# Altium schematic sheet PCB_Reflow_Plate.SchDoc: PCB_Reflow_Plate
size A; SheetNumber: 1; SheetTotal: 1
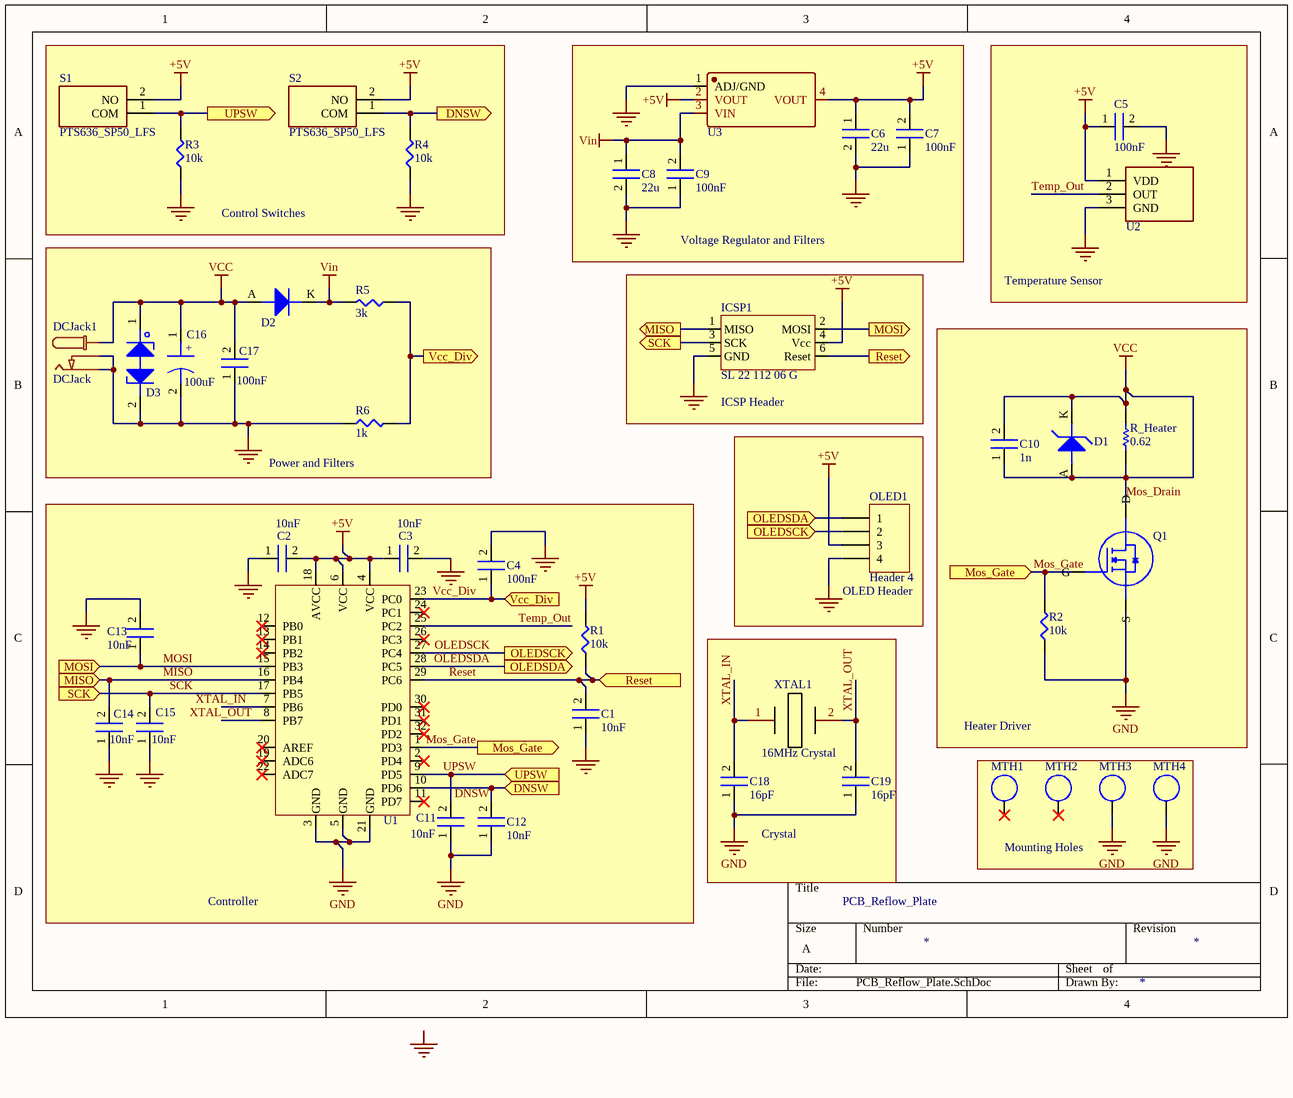
[diagram p0: PCB_Reflow_Plate.SchDoc]

## Parts
C1  Capacitance: 10nF  [0402B103J500CT]  (hidden comment: 10n 0402)
C2  Capacitance: 10nF  [0402B103J500CT]  (hidden comment: 10n 0402)
C3  Capacitance: 10nF  [0402B103J500CT]  (hidden comment: 10n 0402)
C4  Capacitance: 100nF  [0603B104K250CT]  (hidden comment: 100n 0603)
C5  Capacitance: 100nF  [0603B104K250CT]  (hidden comment: 100n 0603)
C6  Capacitance: 22u  [CL21A226MAYNNNE]  (hidden comment: 22u 0805)
C7  Capacitance: 100nF  [0603B104K250CT]  (hidden comment: 100n 0603)
C8  Capacitance: 22u  [CL21A226MAYNNNE]  (hidden comment: 22u 0805)
C9  Capacitance: 100nF  [0603B104K250CT]  (hidden comment: 100n 0603)
C10  Capacitance: 1n  [FM21X102K501PXG]  (hidden comment: 1n 0805)
C11  Capacitance: 10nF  [0402B103J500CT]  (hidden comment: 10n 0402)
C12  Capacitance: 10nF  [0402B103J500CT]  (hidden comment: 10n 0402)
C13  Capacitance: 10nF  [0402B103J500CT]  (hidden comment: 10n 0402)
C14  Capacitance: 10nF  [0402B103J500CT]  (hidden comment: 10n 0402)
C15  Capacitance: 10nF  [0402B103J500CT]  (hidden comment: 10n 0402)
C16  Capacitance: 100uF  [UWT1V101MCL1GS]  (hidden comment: 100u SMD Polarized)
C17  Capacitance: 100nF  [0603B104K250CT]  (hidden comment: 100n 0603)
C18  Capacitance: 16pF  [NMC0603NPO160J50TRPF]  (hidden comment: 16pf 0603 Capacitor)
C19  Capacitance: 16pF  [NMC0603NPO160J50TRPF]  (hidden comment: 16pf 0603 Capacitor)
D1  Zener Diode  [MMSZ24T1G]  (value not drawn)
D2  Diode  [1N4448X-TP]  (value not drawn)
D3  TVS bi-directional  [PESD18VF1BLYL]  (value not drawn)
DCJack1  DCJack  [KLDX-0202-B]
ICSP1  SL 22 112 06 G  [SL 22 112 06 G]
MTH1  Mounting Hole 6mm outer 3mm inner  [MTH_6mmOD_3mmID]  (value not drawn)
MTH2  Mounting Hole 6mm outer 3mm inner  [MTH_6mmOD_3mmID]  (value not drawn)
MTH3  Mounting Hole 6mm outer 3mm inner  [MTH_6mmOD_3mmID]  (value not drawn)
MTH4  Mounting Hole 6mm outer 3mm inner  [MTH_6mmOD_3mmID]  (value not drawn)
OLED1  Header 4  [HDR1X4]
Q1  Mosfet DPAK  [AOD442]  (value not drawn)
R1  Resistance: 10k  [RTT03103JTP]  (hidden comment: 10k 0603)
R2  Resistance: 10k  [RTT03103JTP]  (hidden comment: 10k 0603)
R3  Resistance: 10k  [RTT03103JTP]  (hidden comment: 10k 0603)
R4  Resistance: 10k  [RTT03103JTP]  (hidden comment: 10k 0603)
R5  Resistance: 3k  [RTT05302JTP]  (hidden comment: 3k 0805)
R6  Resistance: 1k  [CR0805-FX-1001ELF]  (hidden comment: 1k 0805)
R_Heater  value 0.62  (hidden comment: Resistor)
S1  PTS636_SP50_LFS  [PTS636_SP50_LFS]
S2  PTS636_SP50_LFS  [PTS636_SP50_LFS]
U1  ATMEGA328P-AU  [atmega328p-au]  (value not drawn)
U2  LMT85LP  [LMT85LP]  (value not drawn)
U3  AMS1117-5.0  [AMS1117-5.0]  (value not drawn)
XTAL1  16MHz Crystal  [ABM7-16.000MHZ-D2Y-T]

## Blocks framed on the sheet
Control Switches: R3 R4 S1 S2
Voltage Regulator and Filters: C6-C9 U3
Temperature Sensor: C5 U2
Power and Filters: C16 C17 D2 D3 DCJack1 R5 R6
ICSP Header: ICSP1
Heater Driver: C10 D1 Q1 R2 R_Heater
OLED Header: OLED1
Controller: C1-C4 C11-C15 R1 U1
Crystal: C18 C19 XTAL1
Mounting Holes: MTH1-MTH4

## Ports
DNSW (in), DNSW (out), MISO (in), MISO (out), Mos_Gate (in), Mos_Gate (out), MOSI (in), MOSI (out), OLEDSCK (in), OLEDSCK (out), OLEDSDA (in), OLEDSDA (out), Reset (in), Reset (out), SCK (in), SCK (out), UPSW (in), UPSW (out), Vcc_Div (in), Vcc_Div (out)

## Nets
+5V: C2.2 C3.1 C5.1 C6.1 C7.2 ICSP1.4(Vcc) OLED1.3 R1.2 S1.2(NO) S2.2(NO) U1.4(VCC) U1.6(VCC) U1.18(AVCC) U2.1(VDD) U3.2(VOUT) U3.4(VOUT)
GND: C1.1 C2.1 C3.2 C4.2 C5.2 C6.2 C7.1 C8.2 C9.1 C11.1 C12.1 C13.2 C14.1 C15.1 C16.2 C17.1 C18.1 C19.1 D3.2 DCJack1.P2 DCJack1.P3 ICSP1.5(GND) MTH3.1 MTH4.1 OLED1.4 Q1.2(S) R2.1 R3.1 R4.1 R6.1 U1.3(GND) U1.5(GND) U1.21(GND) U2.3(GND) U3.1(ADJ/GND)
Mos_Drain: C10.1 C10.2 C16.1 C17.2 D1.A D1.K D2.A D3.1 DCJack1.P1 Q1.1(D) R_Heater.1 R_Heater.2  [also labelled VCC]
Vin: C8.1 C9.2 D2.K R5.2 U3.3(VIN)
DNSW: C12.2 R4.2 S2.1(COM) U1.10(PD6) ; port DNSW
MISO: C14.2 ICSP1.1(MISO) U1.16(PB4) ; port MISO
Mos_Gate: Q1.3(G) R2.2 U1.1(PD3) ; port Mos_Gate
MOSI: C13.1 ICSP1.2(MOSI) U1.15(PB3) ; port MOSI
OLEDSCK: OLED1.2 U1.27(PC4) ; port OLEDSCK
OLEDSDA: OLED1.1 U1.28(PC5) ; port OLEDSDA
Reset: C1.2 ICSP1.6(Reset) R1.1 U1.29(PC6) ; port Reset
SCK: C15.2 ICSP1.3(SCK) U1.17(PB5) ; port SCK
Temp_Out: U1.25(PC2) U2.2(OUT)
UPSW: C11.2 R3.2 S1.1(COM) U1.9(PD5) ; port UPSW
Vcc_Div: C4.1 R5.1 R6.2 U1.23(PC0) ; port Vcc_Div
XTAL_IN: C18.2 U1.7(PB6) XTAL1.1
XTAL_OUT: C19.2 U1.8(PB7) XTAL1.2

Not connected (* = marked no-connect by the designer): MTH1 1*; MTH2 1*; U1 2(PD4)* 11(PD7)* 12(PB0)* 13(PB1)* 14(PB2)* 19(ADC6)* 20(AREF)* 22(ADC7)* 24(PC1)* 26(PC3)* 30(PD0)* 31(PD1)* 32(PD2)*

## Notes on the sheet
- Labels drawn without touching a wire or pin: GND, Mos_Gate
- (in symbol UWT1V101MCL1GS) +

## Library data of the parts
C1-C3 C11-C15 = C1005X7S2A103M050BB: Cap Ceramic 0.01uF 100V X7S 20% SMD 0402 125C Paper T/R; Manufacturer: TDK; Supplier 1: Arrow Electronics; Manufacturer Part Number: C1005X7S2A103M050BB; RoHS: Yes; Category: Ceramic Capacitors; Stock 1: 12146; Pricing 1: 1=0.15740, 10=0.11320, 25=0.08760, 50=0.06570, 100=0.05460, 250=0.05380, 500=0.03850, 1000=0.03230, 3000=0.02830, 6000=0.02780 (USD); Mount: Surface Mount; Case/Package: 0402; Number of Pins: 2; Case Code (Imperial): 0402; Case Code (Metric): 1005; Weight: 2.3E-05oz; Min Operating Temperature: -55°C; Max Operating Temperature: 125°C; Voltage Rating (DC): 100V; Tolerance: 20%; Packaging: Tape and Reel; Voltage Rating: 100V; Dielectric: X7S; Termination: SMD/SMT; Package Quantity: 1; Resistor Type: Ceramic; Series: C; Length: 1mm; Width: 0.5mm; Depth: 0.5mm; Thickness: 0.022inch; Lead Free: Lead Free; RoHS Compliant: Yes; ComponentLink1URL: https://datasheet.ciiva.com/24217/c1005x7s2a103m050bb-264489-24217683.pdf?src-supplier=Mouser; ComponentLink1Description: https://datasheet.ciiva.com/24217/c1005x7s2a103m050bb-264489-24217683.pdf?src-supplier=Mouser; Supplier Part Number 1: C1005X7S2A103M050BB
C4 C5 C7 C9 C17 = GRM188R72A104KA35D: CAP CER 0.1UF 100V X7R 0603; Manufacturer: Murata; Material: Ceramic; Tolerance: 10%; Supplier 1: Arrow Electronics; Manufacturer Part Number: GRM188R72A104KA35D; RoHS: Yes; Category: Ceramic Capacitors; Stock 1: 360000; Pricing 1: 4000=0.04400 (USD); Mount: Surface Mount; Case/Package: 0603; Weight: 0.000222oz; Case Code (Imperial): 0603; Case Code (Metric): 1608; Min Operating Temperature: -55°C; Max Operating Temperature: 125°C; Dielectric: X7R; Voltage Rating: 100V; Voltage Rating (DC): 100V; Packaging: Tape and Reel; Package Quantity: 1; Termination: SMD/SMT; Voltage: 100V; Series: GRM; Construction: Flat; Length: 1.6mm; Width: 0.8mm; Height: 0.8mm; Thickness: 0.035inch; Depth: 0.8mm; Size: 0.8mm; Radiation Hardening: No; REACH SVHC: No SVHC; Lead Free: Lead Free; RoHS Compliant: Yes; ComponentLink1URL: https://datasheet.ciiva.com/22703/1747473-22703345.pdf?src-supplier=Element14; ComponentLink1Description: https://datasheet.ciiva.com/22703/1747473-22703345.pdf?src-supplier=Element14; ComponentLink2URL: https://datasheet.ciiva.com/34302/1857815-34302863.pdf?src-supplier=Jameco; ComponentLink2Description: https://datasheet.ciiva.com/34302/1857815-34302863.pdf?src-supplier=Jameco; ComponentLink3URL: https://datasheet.ciiva.com/11787/0900766b80ef921d-11787064.pdf?src-supplier=RSComponents; ComponentLink3Description: https://datasheet.ciiva.com/11787/0900766b80ef921d-11787064.pdf?src-supplier=RSComponents; ComponentLink4URL: https://datasheet.ciiva.com/18100/getdatasheetpartid-27818-18100710.pdf?src-supplier=Verical; ComponentLink4Description: https://datasheet.ciiva.com/18100/getdatasheetpartid-27818-18100710.pdf?src-supplier=Verical; ComponentLink5URL: https://datasheet.ciiva.com/29201/451984-da-01-en-vs-kondensator-0603-29201725.pdf?src-supplier=Conrad; ComponentLink5Description: https://datasheet.ciiva.com/29201/451984-da-01-en-vs-kondensator-0603-29201725.pdf?src-supplier=Conrad; ComponentLink6URL: https://datasheet.ciiva.com/7937/1747473-7937676.pdf?src-supplier=Element14; ComponentLink6Description: https://datasheet.ciiva.com/7937/1747473-7937676.pdf?src-supplier=Element14; ComponentLink7URL: https://datasheet.ciiva.com/135/partnumbering-e-01-135140.pdf?src-supplier=Digi-Key; ComponentLink7Description: https://datasheet.ciiva.com/135/partnumbering-e-01-135140.pdf?src-supplier=Digi-Key; ComponentLink8URL: https://datasheet.ciiva.com/135/partnumbering-e-01-135139.pdf?src-supplier=Digi-Key; ComponentLink8Description: https://datasheet.ciiva.com/135/partnumbering-e-01-135139.pdf?src-supplier=Digi-Key; ComponentLink9URL: https://datasheet.ciiva.com/135/partnumbering-e-01-135141.pdf?src-supplier=Digi-Key; ComponentLink9Description: https://datasheet.ciiva.com/135/partnumbering-e-01-135141.pdf?src-supplier=Digi-Key; ComponentLink10URL: https://datasheet.ciiva.com/16382/product-16382965.pdf?src-supplier=Future+Electronics; ComponentLink10Description: https://datasheet.ciiva.com/16382/product-16382965.pdf?src-supplier=Future+Electronics; Supplier Part Number 1: GRM188R72A104KA35D
C6 C8 = CL21A226MAYNNNE: 25V 22uF X5R ±20% 0805 Multilayer Ceramic Capacitors MLCC - SMD/SMT ROHS; Manufacturer: Samsung; Supplier 1: LCSC; Manufacturer Part Number: CL21A226MAYNNNE; RoHS: Yes; Category: Ceramic Capacitors; Stock 1: 9380620; Pricing 1: 20=0.01460, 200=0.01420, 600=0.01420, 2000=0.01420, 10000=0.01420, 20000=0.01420 (USD); RoHS Compliant: Yes; Supplier Part Number 1: C602037
C10 = GRM21AR72E102KW01D: 0805 1 nF 250 V ±10% Tolerance X7R SMT Multilayer Ceramic Capacitor; Manufacturer: Murata; Voltage Rating: 250V; Supplier 1: Arrow Electronics; Manufacturer Part Number: GRM21AR72E102KW01D; RoHS: Yes; Category: Ceramic Capacitors; Stock 1: 28000; Pricing 1: 4000=0.07440, 8000=0.06810, 12000=0.06640, 28000=0.06360, 100000=0.05520 (USD); Mount: Surface Mount; Case/Package: 0805; Case Code (Metric): 2012; Case Code (Imperial): 0805; Material: Ceramic; Min Operating Temperature: -55°C; Max Operating Temperature: 125°C; Tolerance: 10%; Dielectric: X7R; Package Quantity: 4000; Packaging: Tape and Reel; Voltage Rating (DC): 250V; Termination: SMD/SMT; Voltage: 250V; Series: GRM; Construction: Flat; Length: 2mm; Width: 1.25mm; Height: 1mm; Depth: 1.25mm; Thickness: 0.039inch; Radiation Hardening: No; Lead Free: Lead Free; RoHS Compliant: Yes; ComponentLink1URL: https://datasheet.ciiva.com/3778/12716grm21ar72e102kw0123-3778089.pdf?src-supplier=Arrow+Electronics; ComponentLink1Description: https://datasheet.ciiva.com/3778/12716grm21ar72e102kw0123-3778089.pdf?src-supplier=Arrow+Electronics; ComponentLink2URL: https://datasheet.ciiva.com/134/partnumbering-e-01-134212.pdf?src-supplier=Digi-Key; ComponentLink2Description: https://datasheet.ciiva.com/134/partnumbering-e-01-134212.pdf?src-supplier=Digi-Key; ComponentLink3URL: https://datasheet.ciiva.com/134/partnumbering-e-01-134213.pdf?src-supplier=Digi-Key; ComponentLink3Description: https://datasheet.ciiva.com/134/partnumbering-e-01-134213.pdf?src-supplier=Digi-Key; ComponentLink4URL: https://datasheet.ciiva.com/134/partnumbering-e-01-134214.pdf?src-supplier=Digi-Key; ComponentLink4Description: https://datasheet.ciiva.com/134/partnumbering-e-01-134214.pdf?src-supplier=Digi-Key; Supplier Part Number 1: GRM21AR72E102KW01D
C16 = UWT1V101MCL1GS: -45℃~+105℃ 1000hrs@105℃ 100uF 7.7mm 35V 6.3mm ±20% SMD,D6.3xL7.7mm Aluminum Electrolytic Capacitors - SMD ROHS; Manufacturer: Nichicon; Dielectric Material: Aluminium; Ripple Current (AC): 84mA; Leakage Current: 3uA; Life (Hours): 1000Hour; Dissipation Factor: 0.14%; Lead Diameter: 0.8mm; Supplier 1: LCSC; Manufacturer Part Number: UWT1V101MCL1GS; RoHS: Yes; Category: Aluminum Electrolytic Capacitors; Stock 1: 986890; Pricing 1: 5=0.08560, 50=0.06960, 150=0.06140, 500=0.05460, 2500=0.05220, 5000=0.05060 (USD); Mount: Surface Mount,PCB; Case/Package: Radial; Number of Pins: 2; Min Operating Temperature: -55°C; Max Operating Temperature: 105°C; Tolerance: 20%; Voltage Rating: 35V; Packaging: Tape and Reel; Package Quantity: 900; Ripple Current: 84mA; Voltage Rating (DC): 35V; Termination: SMD/SMT; Voltage: 35V; Series: WT; Construction: Cylindrical; Diameter: 6.3mm; Length: 7.7mm; Height: 7.7mm; Lead Pitch: 2.2mm; Height - Seated (Max): 0.303inch; Radiation Hardening: No; REACH SVHC: No SVHC; Lead Free: Lead Free; RoHS Compliant: Yes; ComponentLink1URL: https://datasheet.ciiva.com/96/e-wt-96660.pdf?src-supplier=Digi-Key; ComponentLink1Description: https://datasheet.ciiva.com/96/e-wt-96660.pdf?src-supplier=Digi-Key; ComponentLink2URL: https://datasheet.ciiva.com/96/e-wt-96659.pdf?src-supplier=Digi-Key; ComponentLink2Description: https://datasheet.ciiva.com/96/e-wt-96659.pdf?src-supplier=Digi-Key; ComponentLink3URL: https://datasheet.ciiva.com/96/e-wt-96661.pdf?src-supplier=Digi-Key; ComponentLink3Description: https://datasheet.ciiva.com/96/e-wt-96661.pdf?src-supplier=Digi-Key; ComponentLink4URL: https://datasheet.ciiva.com/11778/0900766b80fa3a91-11778473.pdf?src-supplier=RSComponents; ComponentLink4Description: https://datasheet.ciiva.com/11778/0900766b80fa3a91-11778473.pdf?src-supplier=RSComponents; ComponentLink5URL: https://datasheet.ciiva.com/11687/e-wt-11687372.pdf?src-supplier=Avnet; ComponentLink5Description: https://datasheet.ciiva.com/11687/e-wt-11687372.pdf?src-supplier=Avnet; ComponentLink6URL: https://datasheet.ciiva.com/16294/e-wt-16294316.pdf?src-supplier=Future+Electronics; ComponentLink6Description: https://datasheet.ciiva.com/16294/e-wt-16294316.pdf?src-supplier=Future+Electronics; ComponentLink7URL: https://datasheet.ciiva.com/15199/getdatasheetpartid-450031-15199274.pdf?src-supplier=Verical; ComponentLink7Description: https://datasheet.ciiva.com/15199/getdatasheetpartid-450031-15199274.pdf?src-supplier=Verical; Supplier Part Number 1: C125975
C18 C19 = NMC0603NPO160J50TRPF: Cap Ceramic 16pF 50V C0G 5% SMD 0603 125°C Paper T/R; Manufacturer: NIC Components; Supplier 1: Arrow Electronics; Manufacturer Part Number: NMC0603NPO160J50TRPF; RoHS: Yes; Category: Ceramic Capacitors; Stock 1: 3200; Pricing 1: 1=0.00630, 10=0.00560, 25=0.00470 (USD); Mount: Surface Mount; Case/Package: 0603; Min Operating Temperature: -55°C; Max Operating Temperature: 125°C; Tolerance: 5%; Packaging: Tape and Reel; Dielectric: C0G; Construction: Flat; Length: 1.6mm; Depth: 0.8mm; Radiation Hardening: No; RoHS Compliant: Yes; ComponentLink1URL: https://datasheet.ciiva.com/11602/nmc1-11602959.pdf?src-supplier=Avnet; ComponentLink1Description: https://datasheet.ciiva.com/11602/nmc1-11602959.pdf?src-supplier=Avnet; Supplier Part Number 1: NMC0603NPO160J50TRPF
D1 = MMSZ24T1G: Zener Single Diode, 24 V, 500 mW, SOD-123, 5 %, 2, 150 C RoHS Compliant: Yes; Manufacturer: ON Semiconductor; Max Power Dissipation: 500mW; Zener Voltage: 24V; Max Reverse Leakage Current: 50nA; Tolerance: 5%; Impedance: 70R; Test Current: 5mA; Forward Voltage: 900mV; Zener Current: 10mA; Supplier 1: Arrow Electronics; Manufacturer Part Number: MMSZ24T1G; RoHS: Yes; Category: Zener Diodes; Stock 1: 86820; Pricing 1: 1=0.22650, 10=0.18600, 25=0.17690, 100=0.10080, 250=0.09980, 500=0.07220, 1000=0.05330, 3000=0.04250, 6000=0.03220, 15000=0.02660, 30000=0.02630, 75000=0.02610 (USD); Case/Package: SOD-123-2; Number of Pins: 2; Contact Plating: Tin,Matte; Min Operating Temperature: -55°C; Max Operating Temperature: 150°C; Packaging: Tape and Reel; Element Configuration: Single; Package Quantity: 1; Voltage Tolerance: 5%; Power Rating: 500mW; Voltage Rating (DC): 24V; Power Dissipation: 500mW; Working Voltage: 24V; Max Reverse Current: 50nA; ESD Protection: Yes; Length: 2.84mm; Width: 1.8mm; Height: 1.25mm; Radiation Hardening: No; Lead Free: Lead Free; REACH SVHC: No SVHC; ComponentLink1URL: https://datasheet.ciiva.com/15142/getdatasheetpartid-53226-15142109.pdf?src-supplier=Verical; ComponentLink1Description: https://datasheet.ciiva.com/15142/getdatasheetpartid-53226-15142109.pdf?src-supplier=Verical; ComponentLink2URL: https://datasheet.ciiva.com/895/mmsz2v4t1-d-895073.pdf?src-supplier=Digi-Key; ComponentLink2Description: https://datasheet.ciiva.com/895/mmsz2v4t1-d-895073.pdf?src-supplier=Digi-Key; ComponentLink3URL: https://datasheet.ciiva.com/895/mmsz2v4t1-d-895074.pdf?src-supplier=Digi-Key; ComponentLink3Description: https://datasheet.ciiva.com/895/mmsz2v4t1-d-895074.pdf?src-supplier=Digi-Key; ComponentLink4URL: https://datasheet.ciiva.com/895/mmsz2v4t1-d-895075.pdf?src-supplier=Digi-Key; ComponentLink4Description: https://datasheet.ciiva.com/895/mmsz2v4t1-d-895075.pdf?src-supplier=Digi-Key; ComponentLink5URL: https://datasheet.ciiva.com/16396/mmsz2v4t1-d-16396045.pdf?src-supplier=Future+Electronics; ComponentLink5Description: https://datasheet.ciiva.com/16396/mmsz2v4t1-d-16396045.pdf?src-supplier=Future+Electronics; Supplier Part Number 1: MMSZ24T1G
D2 = 1N4448X-TP: 1N4448X Series 4 A 75 V 150 mW Surface Mount Switching Diode - SOD-523; Manufacturer: MCC; Forward Current: 500mA; Max Surge Current: 4A; Forward Voltage: 1.25V; Recovery Time: 4ns; Polarity: Standard; Voltage Rating (DC): 75V; Current Rating: 150mA; Capacitance: 4pF; Average Rectified Current: 250mA; Max Reverse Leakage Current: 2.5uA; Power Dissipation: 150mW; Element Configuration: Single; Supplier 1: Arrow Electronics; Manufacturer Part Number: 1N4448X-TP; RoHS: Yes; Category: Rectifier Diodes; Stock 1: 216000; Pricing 1: 8000=0.03630, 24000=0.03380, 48000=0.02910 (USD); Mount: Surface Mount; Number of Pins: 2; Min Operating Temperature: -65°C; Max Operating Temperature: 150°C; Package Quantity: 1; Packaging: Tape and Reel; Output Current: 500mA; Reverse Recovery Time: 4ns; Max Repetitive Reverse Voltage (Vrrm): 75V; Peak Non-Repetitive Surge Current: 4A; Max Reverse Voltage (DC): 75V; Lead Free: Lead Free; ComponentLink1URL: https://datasheet.ciiva.com/916/1n4448xsod-523-916912.pdf?src-supplier=Digi-Key; ComponentLink1Description: https://datasheet.ciiva.com/916/1n4448xsod-523-916912.pdf?src-supplier=Digi-Key; ComponentLink2URL: https://datasheet.ciiva.com/16836/1n4448xsod-523-16836341.pdf?src-supplier=Future+Electronics; ComponentLink2Description: https://datasheet.ciiva.com/16836/1n4448xsod-523-16836341.pdf?src-supplier=Future+Electronics; Supplier Part Number 1: 1N4448X-TP
D3 = PESD18VF1BLYL: TVS DIODE 18VWM 17VC SOD882; Manufacturer: Nexperia; Supplier 1: Arrow Electronics; Manufacturer Part Number: PESD18VF1BLYL; RoHS: Yes; Category: ESD and Circuit Protection ICs; Stock 1: 6792; Pricing 1: 1=0.35670, 10=0.07470, 25=0.07380, 100=0.07320, 250=0.06160, 500=0.06100, 1000=0.05850, 3000=0.05790, 6000=0.05730 (USD); RoHS Compliant: Yes; ComponentLink1URL: http://www.farnell.com/datasheets/1738914.pdf?src-supplier=Farnell; ComponentLink1Description: http://www.farnell.com/datasheets/1738914.pdf?src-supplier=Farnell; ComponentLink2URL: http://www.farnell.com/datasheets/1738914.pdf?src-supplier=Newark; ComponentLink2Description: http://www.farnell.com/datasheets/1738914.pdf?src-supplier=Newark; ComponentLink3URL: https://assets.nexperia.com/documents/data-sheet/PESD18VF1BL.pdf?src-supplier=Digi-Key; ComponentLink3Description: https://assets.nexperia.com/documents/data-sheet/PESD18VF1BL.pdf?src-supplier=Digi-Key; Supplier Part Number 1: PESD18VF1BLYL
DCJack1 = KLDX-0202-B: Conn Power PIN 2 POS Solder RA Thru-Hole 3 Terminal 1 Port; Manufacturer: Kycon; Gender: Female; Current Rating: 3.5A; Voltage Rating: 24V; Insulation Resistance: 100MR; Number of Contacts: 2; Supplier 1: Digi-Key; Manufacturer Part Number: KLDX-0202-B; RoHS: Yes; Category: Power Connectors; Stock 1: 90692; Pricing 1: 1=0.74000, 10=0.62400, 25=0.59800, 50=0.58540, 100=0.55990, 250=0.50904, 500=0.45814, 1000=0.40723, 2500=0.36906 (USD); Mount: Through Hole; Contact Material: Brass; Contact Plating: Tin; Housing Material: PBT; Color: Black; Min Operating Temperature: -25°C; Max Operating Temperature: 85°C; Connector Type: Power; Packaging: Bag; Termination: Solder; Contact Gender: Female; Package Quantity: 500; Voltage Rating (DC): 24V; Orientation: Right Angle; Flammability Rating: UL94 V-0; ComponentLink1URL: https://datasheet.ciiva.com/4561/kldx-0202-x-184473-4561491.pdf?src-supplier=Mouser; ComponentLink1Description: https://datasheet.ciiva.com/4561/kldx-0202-x-184473-4561491.pdf?src-supplier=Mouser; Supplier Part Number 1: 2092-KLDX-0202-B-ND
ICSP1 = SL 22 112 06 G: Conn Unshrouded Header M 6 POS 2.54mm Solder ST Thru-Hole; Manufacturer: Fischer Elektronik; Max Current Rating: 3A; Max Voltage Rating (AC): 250V; Gender: Male; Supplier 1: Arrow Electronics; Manufacturer Part Number: SL 22 112 06 G; RoHS: Yes; Category: Headers and Wire Housings; Stock 1: 6120; Pricing 1: 1=0.53140, 25=0.53130, 50=0.53120, 100=0.53110 (USD); Contact Plating: Gold; Contact Material: Bronze; Housing Material: Polyamide; Min Operating Temperature: -40°C; Max Operating Temperature: 163°C; Number of Rows: 2; Termination: Solder; Orientation: Straight; Length: 15.24mm; Pitch: 2.54mm; Depth: 5mm; ComponentLink1URL: https://datasheet.ciiva.com/26853/getdatasheetpartid-646250-26853533.pdf?src-supplier=Verical; ComponentLink1Description: https://datasheet.ciiva.com/26853/getdatasheetpartid-646250-26853533.pdf?src-supplier=Verical; Supplier Part Number 1: SL 22 112 06 G
MTH1-MTH4 = MTH_6mmOD_3mmID: Mounting Hole 6mm outer 3mm inner drill
OLED1 = Header 4: Header, 4-Pin; LatestRevisionDate: 17-Jul-2002; LatestRevisionNote: Re-released for DXP Platform.; Publisher: Altium Limited
Q1 = AOD442: Trans MOSFET N-CH 60V 37A 3-Pin(2+Tab) DPAK; Manufacturer: Alpha & Omega Semiconductor; Rds On Max: 20mR; Input Capacitance: 2.3nF; Max Power Dissipation: 2.1W; Gate to Source Voltage (Vgs): 20V; Number of Elements: 1; Power Dissipation: 60W; Supplier 1: LCSC; Manufacturer Part Number: AOD442; RoHS: Yes; Category: MOSFETs; Stock 1: 14654; Pricing 1: 1=0.66730, 10=0.54640, 30=0.48690, 100=0.42740, 500=0.39140, 1000=0.37330 (USD); Mount: Surface Mount; Case/Package: DPAK; Number of Pins: 3; Min Operating Temperature: -55°C; Max Operating Temperature: 175°C; Packaging: Tape and Reel; Drain to Source Voltage (Vdss): 60V; Continuous Drain Current (ID): 37A; Radiation Hardening: No; Lead Free: Lead Free; ComponentLink1URL: https://datasheet.ciiva.com/6384/aod442-6384657.pdf?src-supplier=Digi-Key; ComponentLink1Description: https://datasheet.ciiva.com/6384/aod442-6384657.pdf?src-supplier=Digi-Key; ComponentLink2URL: https://datasheet.ciiva.com/6384/aod442-6384651.pdf?src-supplier=Digi-Key; ComponentLink2Description: https://datasheet.ciiva.com/6384/aod442-6384651.pdf?src-supplier=Digi-Key; ComponentLink3URL: https://datasheet.ciiva.com/6384/aod442-6384654.pdf?src-supplier=Digi-Key; ComponentLink3Description: https://datasheet.ciiva.com/6384/aod442-6384654.pdf?src-supplier=Digi-Key; Supplier Part Number 1: C87617
R1-R4 = RT0603DRE0710KL: Res Thin Film 0603 10K Ohm 0.5% 0.1W(1/10W) ±50ppm/°C Pad SMD T/R; Manufacturer: Yageo; Power Rating: 100mW; Voltage Rating: 75V; Voltage Rating (DC): 50V; Supplier 1: Arrow Electronics; Manufacturer Part Number: RT0603DRE0710KL; RoHS: Yes; Category: Chip SMD Resistors; Stock 1: 4505; Pricing 1: 1=0.09190, 10=0.07850, 25=0.04030, 100=0.02970, 250=0.01780, 500=0.01770, 1000=0.01580, 3000=0.01220 (USD); Case/Package: 0603; Case Code (Metric): 1608; Case Code (Imperial): 0603; Size Code: 0603; Min Operating Temperature: -55°C; Max Operating Temperature: 125°C; Package Quantity: 5000; Packaging: Tape and Reel; Tolerance: 0.5%; Resistor Type: Thin Film; Number of Terminations: 2; Termination: SMD/SMT; Max Power Dissipation: 100mW; Temperature Coefficient: 50ppm/°C; Features: Moisture Resistant; Series: RT; Construction: Rectangular; Length: 0.063inch; Width: 0.031inch; Height: 0.022inch; Depth: 0.8mm; RoHS Compliant: Yes; Military Standard: Not; Lead Free: Lead Free; ComponentLink1URL: https://datasheet.ciiva.com/2565/pyu-rt-1-to-0-05-rohs-l-5-2565939.pdf?src-supplier=Digi-Key; ComponentLink1Description: https://datasheet.ciiva.com/2565/pyu-rt-1-to-0-05-rohs-l-5-2565939.pdf?src-supplier=Digi-Key; Supplier Part Number 1: RT0603DRE0710KL
R5 = RC0805FR-073KL: Res Thick Film 0805 3K Ohm 1% 0.125W(1/8W) ±100ppm/C Pad SMD T/R; Manufacturer: Yageo; Temperature Coefficient: 100ppm/°C; Voltage Rating (DC): 150V; Power Rating: 125mW; Supplier 1: Arrow Electronics; Manufacturer Part Number: RC0805FR-073KL; RoHS: Yes; Category: Chip SMD Resistors; Stock 1: 75000; Pricing 1: 5000=0.00470 (USD); Mount: Surface Mount; Case/Package: 0805; Case Code (Metric): 2012; Case Code (Imperial): 0805; Size Code: 0805; Min Operating Temperature: -55°C; Max Operating Temperature: 155°C; Tolerance: 1%; Packaging: Tape and Reel; Resistor Type: Thick Film; Package Quantity: 1; Voltage Rating: 150V; Number of Terminations: 2; Termination: SMD/SMT; Max Power Dissipation: 125mW; Features: Moisture Resistant; Series: RC; Construction: Rectangular; Length: 2mm; Width: 0.049inch; Height: 0.024inch; Depth: 1.25mm; Lead Free: Lead Free; Military Standard: Not; RoHS Compliant: Yes; ComponentLink1URL: https://datasheet.ciiva.com/2457/pyu-r-int-thick-7-2457135.pdf?src-supplier=Digi-Key; ComponentLink1Description: https://datasheet.ciiva.com/2457/pyu-r-int-thick-7-2457135.pdf?src-supplier=Digi-Key; ComponentLink2URL: https://datasheet.ciiva.com/2457/pyu-r-int-thick-7-2457136.pdf?src-supplier=Digi-Key; ComponentLink2Description: https://datasheet.ciiva.com/2457/pyu-r-int-thick-7-2457136.pdf?src-supplier=Digi-Key; ComponentLink3URL: https://datasheet.ciiva.com/2457/pyu-r-int-thick-7-2457134.pdf?src-supplier=Digi-Key; ComponentLink3Description: https://datasheet.ciiva.com/2457/pyu-r-int-thick-7-2457134.pdf?src-supplier=Digi-Key; ComponentLink4URL: https://datasheet.ciiva.com/5558/rc0805-5558124.pdf?src-supplier=Mouser; ComponentLink4Description: https://datasheet.ciiva.com/5558/rc0805-5558124.pdf?src-supplier=Mouser; ComponentLink5URL: https://datasheet.ciiva.com/17043/rc0805-17043750.pdf?src-supplier=Future+Electronics; ComponentLink5Description: https://datasheet.ciiva.com/17043/rc0805-17043750.pdf?src-supplier=Future+Electronics; Supplier Part Number 1: RC0805FR-073KL
R6 = CR0805-FX-1001ELF: 125mW ±100ppm/℃ ±1% 1kΩ 0805 Chip Resistor - Surface Mount ROHS; Manufacturer: Bourns; Temperature Coefficient: 100ppm/°C; Voltage Rating: 150V; Supplier 1: Arrow Electronics; Manufacturer Part Number: CR0805-FX-1001ELF; RoHS: Yes; Category: Chip SMD Resistors; Stock 1: 100000; Pricing 1: 100000=0.00430 (USD); Mount: Surface Mount; Case/Package: 0805; Number of Pins: 2; Contact Plating: Tin; Case Code (Imperial): 0805; Case Code (Metric): 2012; Min Operating Temperature: -55°C; Max Operating Temperature: 155°C; Tolerance: 1%; Resistor Type: Thick Film; Packaging: Tape and Reel; Power Rating: 125mW; Package Quantity: 1; Termination: SMD/SMT; Number of Terminations: 2; Max Power Dissipation: 125mW; Voltage Rating (DC): 150V; Features: Moisture Resistant; Series: CR0805; Resistance Tolerance: 1%; Technology: THICK FILM; Length: 2mm; Width: 1.25mm; Height: 0.5mm; Depth: 1.25mm; Thickness: 508um; Radiation Hardening: No; REACH SVHC: No SVHC; RoHS Compliant: Yes; ComponentLink1URL: https://datasheet.ciiva.com/11810/0900766b80fcdb72-11810305.pdf?src-supplier=RSComponents; ComponentLink1Description: https://datasheet.ciiva.com/11810/0900766b80fcdb72-11810305.pdf?src-supplier=RSComponents; ComponentLink2URL: https://datasheet.ciiva.com/27049/775383-27049976.pdf?src-supplier=Jameco; ComponentLink2Description: https://datasheet.ciiva.com/27049/775383-27049976.pdf?src-supplier=Jameco; ComponentLink3URL: https://datasheet.ciiva.com/16722/70154685-16722677.pdf?src-supplier=Allied+Electronics; ComponentLink3Description: https://datasheet.ciiva.com/16722/70154685-16722677.pdf?src-supplier=Allied+Electronics; ComponentLink4URL: https://datasheet.ciiva.com/9123/chpreztr-9123643.pdf?src-supplier=Avnet; ComponentLink4Description: https://datasheet.ciiva.com/9123/chpreztr-9123643.pdf?src-supplier=Avnet; ComponentLink5URL: https://datasheet.ciiva.com/6547/chpreztr-6547421.pdf?src-supplier=Digi-Key; ComponentLink5Description: https://datasheet.ciiva.com/6547/chpreztr-6547421.pdf?src-supplier=Digi-Key; ComponentLink6URL: https://datasheet.ciiva.com/30129/159chpreztr-30129981.pdf?src-supplier=Onlinecomponents.com; ComponentLink6Description: https://datasheet.ciiva.com/30129/159chpreztr-30129981.pdf?src-supplier=Onlinecomponents.com; ComponentLink7URL: https://datasheet.ciiva.com/6547/chpreztr-6547422.pdf?src-supplier=Digi-Key; ComponentLink7Description: https://datasheet.ciiva.com/6547/chpreztr-6547422.pdf?src-supplier=Digi-Key; ComponentLink8URL: https://datasheet.ciiva.com/46394/691949-46394380.pdf?src-supplier=Element14; ComponentLink8Description: https://datasheet.ciiva.com/46394/691949-46394380.pdf?src-supplier=Element14; ComponentLink9URL: https://datasheet.ciiva.com/7986/1856384-7986222.pdf?src-supplier=Element14; ComponentLink9Description: https://datasheet.ciiva.com/7986/1856384-7986222.pdf?src-supplier=Element14; ComponentLink10URL: https://datasheet.ciiva.com/6547/chpreztr-6547423.pdf?src-supplier=Digi-Key; ComponentLink10Description: https://datasheet.ciiva.com/6547/chpreztr-6547423.pdf?src-supplier=Digi-Key; ComponentLink11URL: https://datasheet.ciiva.com/48692/001055506-da-01-en-smd-wid-cr0805-fx-1001elf-1k-ohm-1-8w-48692106.pdf?src-supplier=Conrad; ComponentLink11Description: https://datasheet.ciiva.com/48692/001055506-da-01-en-smd-wid-cr0805-fx-1001elf-1k-ohm-1-8w-48692106.pdf?src-supplier=Conrad; Supplier Part Number 1: CR0805-FX-1001ELF
R_Heater = Resistor: TC1: 0; SimulationGenericComponent: True; TC2: 0
S1 S2 = PTS636_SP50_LFS: Switch; Manufacturer: C & K COMPONENTS; Manufacturer Part Number: PTS636 SP50 LFS; Datasheet Link: https://www.ckswitches.com/media/2779/pts636.pdf; Height: 4.5mm; Supplier 1: Arrow Electronics; Arrow Price/Stock: https://www.arrow.com/en/products/pts636-sp50-lfs/ck; Supplier Part Number 1: PTS636 SP50 LFS
U1 = ATMEGA328P-AU: 2KB 16K@x16bit -40℃~+85℃ 1.8V~5.5V AVR 1@x8ch/10bit Internal oscillator included 20MHz 23 1KB TQFP-32_7x7x08P Microcontroller Units (MCUs/MPUs/SOCs) ROHS; Manufacturer: Microchip; Supplier 1: LCSC; Manufacturer Part Number: ATMEGA328P-AU; RoHS: Yes; Category: Microcontrollers; Stock 1: 9922; Pricing 1: 1=4.54970, 10=4.01960, 30=3.74910, 100=3.38840, 500=3.25860, 1000=3.20270 (USD); Case/Package: TQFP; RoHS Compliant: Yes; ComponentLink1URL: http://www.farnell.com/datasheets/2047852.pdf?src-supplier=Farnell; ComponentLink1Description: http://www.farnell.com/datasheets/2047852.pdf?src-supplier=Farnell; ComponentLink2URL: https://4donline.ihs.com/images/VipMasterIC/IC/ATML/ATML-S-A0002642585/ATML-S-A0002642585-1.pdf?hkey=6D3A4C79FDBF58556ACFDE234799DDF0&src-supplier=Farnell; ComponentLink2Description: https://4donline.ihs.com/images/VipMasterIC/IC/ATML/ATML-S-A0002642585/ATML-S-A0002642585-1.pdf?hkey=6D3A4C79FDBF58556ACFDE234799DDF0&src-supplier=Farnell; ComponentLink3URL: https://4donline.ihs.com/images/VipMasterIC/IC/ATML/ATML-S-A0002642585/ATML-S-A0002642585-1.pdf?src-supplier=Element14; ComponentLink3Description: https://4donline.ihs.com/images/VipMasterIC/IC/ATML/ATML-S-A0002642585/ATML-S-A0002642585-1.pdf?src-supplier=Element14; ComponentLink4URL: http://www.farnell.com/datasheets/798182.pdf?src-supplier=Newark; ComponentLink4Description: http://www.farnell.com/datasheets/798182.pdf?src-supplier=Newark; ComponentLink5URL: http://www.microchip.com/mymicrochip/filehandler.aspx?ddocname=en589968&src-supplier=Digi-Key; ComponentLink5Description: http://www.microchip.com/mymicrochip/filehandler.aspx?ddocname=en589968&src-supplier=Digi-Key; Supplier Part Number 1: C14877
U2 = LMT85LP: 1.8V-Capable, 10 uA Analog Output Temperature Sensor in SC70 and TO-92 3-TO-92 -50 to 150; Manufacturer: Texas Instruments; Output Type: Analog Voltage,Analog; Min Supply Voltage: 1.8V; Max Supply Voltage: 5.5V; Supplier 1: Arrow Electronics; Manufacturer Part Number: LMT85LP; RoHS: Yes; Category: Integrated Circuits (ICs); Stock 1: 1882; Pricing 1: 1=1.02040, 10=0.74280, 25=0.73520, 100=0.53290, 250=0.52760, 500=0.50920, 1000=0.49080 (USD); Mount: Through Hole; Case/Package: TO-226-3; Number of Pins: 3; Min Operating Temperature: -50°C; Max Operating Temperature: 150°C; Packaging: Bulk; Interface: Analog; RoHS Compliant: Yes; Lead Free: Lead Free; REACH SVHC: No SVHC; ComponentLink1URL: http://components.arrow.com/part/dataview/66446727S843532N7713?src-supplier=Arrow+Electronics; ComponentLink1Description: http://components.arrow.com/part/dataview/66446727S843532N7713?src-supplier=Arrow+Electronics; ComponentLink2URL: http://www.ti.com/general/docs/lit/getliterature.tsp?genericPartNumber=LMT85&fileType=pdf&src-supplier=Farnell; ComponentLink2Description: http://www.ti.com/general/docs/lit/getliterature.tsp?genericPartNumber=LMT85&fileType=pdf&src-supplier=Farnell; ComponentLink3URL: http://www.farnell.com/datasheets/2001682.pdf?src-supplier=Element14; ComponentLink3Description: http://www.farnell.com/datasheets/2001682.pdf?src-supplier=Element14; ComponentLink4URL: http://www.ti.com/general/docs/suppproductinfo.tsp?distId=10&amp;gotoUrl=http%3A%2F%2Fwww.ti.com%2Flit%2Fgpn%2Flmt85&src-supplier=Digi-Key; ComponentLink4Description: http://www.ti.com/general/docs/suppproductinfo.tsp?distId=10&amp;gotoUrl=http%3A%2F%2Fwww.ti.com%2Flit%2Fgpn%2Flmt85&src-supplier=Digi-Key; ComponentLink5URL: http://www.ti.com/lit/gpn/lmt85?src-supplier=Mouser; ComponentLink5Description: http://www.ti.com/lit/gpn/lmt85?src-supplier=Mouser; ComponentLink6URL: http://www.ti.com/general/docs/lit/getliterature.tsp?genericPartNumber=LMT85-Q1&&fileType=pdf&src-supplier=Avnet; ComponentLink6Description: http://www.ti.com/general/docs/lit/getliterature.tsp?genericPartNumber=LMT85-Q1&&fileType=pdf&src-supplier=Avnet; Supplier Part Number 1: LMT85LP
U3 = AMS1117-5.0: 1A 70dB@(120Hz) 5mA 1.4V@1A -40℃~+125℃@(Tj) Fixed 5V~5V Positive 0.003%Vout 1 20V High-current SOT-223-3 Linear Voltage Regulators (LDO) ROHS; Manufacturer: WPMtek; Supplier 1: LCSC; Manufacturer Part Number: AMS1117-5.0; RoHS: No; Category: Uncategorized; Stock 1: 1560; Pricing 1: 5=0.07700, 50=0.06190, 150=0.05430, 500=0.04860, 2500=0.04410, 5000=0.04180 (USD); Supplier Part Number 1: C2909825
XTAL1 = ABM7-16.000MHZ-D2Y-T: Crystal 16MHz ±20ppm (Tol) ±30ppm (Stability) 18pF FUND 50Ohm 2-Pin Mini-CSMD T/R; Manufacturer: Abracon; ESR (Equivalent Series Resistance): 50R; Supplier 1: Arrow Electronics; Manufacturer Part Number: ABM7-16.000MHZ-D2Y-T; RoHS: Yes; Category: Crystals; Stock 1: 40; Pricing 1: 1=0.86850, 10=0.72440, 25=0.71710 (USD); Mount: Surface Mount; Case/Package: CSMD; Number of Pins: 2; Min Operating Temperature: -40°C; Max Operating Temperature: 85°C; Frequency Tolerance: 20ppm; Load Capacitance: 18pF; Frequency: 16MHz; Package Quantity: 1000; Tolerance: 20ppm; Packaging: Tape and Reel; Frequency Stability: 30ppm; Termination: SMD/SMT; Resistor Type: Ceramic; Series: ABM7; Operating Frequency: 16 MHz; Length: 6mm; Width: 3.3mm; Height: 0.055inch; Depth: 3.5mm; Radiation Hardening: No; REACH SVHC: Unknown; Lead Free: Lead Free; ComponentLink1URL: https://datasheet.ciiva.com/15116/getdatasheetpartid-721624-15116835.pdf?src-supplier=Verical; ComponentLink1Description: https://datasheet.ciiva.com/15116/getdatasheetpartid-721624-15116835.pdf?src-supplier=Verical; ComponentLink2URL: https://datasheet.ciiva.com/5788/abm7-5788054.pdf?src-supplier=Farnell; ComponentLink2Description: https://datasheet.ciiva.com/5788/abm7-5788054.pdf?src-supplier=Farnell; ComponentLink3URL: https://datasheet.ciiva.com/7998/947971-7998600.pdf?src-supplier=Element14; ComponentLink3Description: https://datasheet.ciiva.com/7998/947971-7998600.pdf?src-supplier=Element14; ComponentLink4URL: https://datasheet.ciiva.com/22658/947971-22658293.pdf?src-supplier=Element14; ComponentLink4Description: https://datasheet.ciiva.com/22658/947971-22658293.pdf?src-supplier=Element14; ComponentLink5URL: https://datasheet.ciiva.com/46385/947971-46385243.pdf?src-supplier=Element14; ComponentLink5Description: https://datasheet.ciiva.com/46385/947971-46385243.pdf?src-supplier=Element14; ComponentLink6URL: https://datasheet.ciiva.com/18649/abm7-18649866.pdf?src-supplier=Digi-Key; ComponentLink6Description: https://datasheet.ciiva.com/18649/abm7-18649866.pdf?src-supplier=Digi-Key; ComponentLink7URL: https://datasheet.ciiva.com/18649/abm7-18649865.pdf?src-supplier=Digi-Key; ComponentLink7Description: https://datasheet.ciiva.com/18649/abm7-18649865.pdf?src-supplier=Digi-Key; ComponentLink8URL: https://datasheet.ciiva.com/18649/abm7-18649867.pdf?src-supplier=Digi-Key; ComponentLink8Description: https://datasheet.ciiva.com/18649/abm7-18649867.pdf?src-supplier=Digi-Key; ComponentLink9URL: https://datasheet.ciiva.com/16383/abm7-16383174.pdf?src-supplier=Future+Electronics; ComponentLink9Description: https://datasheet.ciiva.com/16383/abm7-16383174.pdf?src-supplier=Future+Electronics; ComponentLink10URL: https://datasheet.ciiva.com/26941/getdatasheetpartid-719818-26941724.pdf?src-supplier=Verical; ComponentLink10Description: https://datasheet.ciiva.com/26941/getdatasheetpartid-719818-26941724.pdf?src-supplier=Verical; Supplier Part Number 1: ABM7-16.000MHZ-D2Y-T